# EAGLE design buckboost (EAGLE 6.6.0)
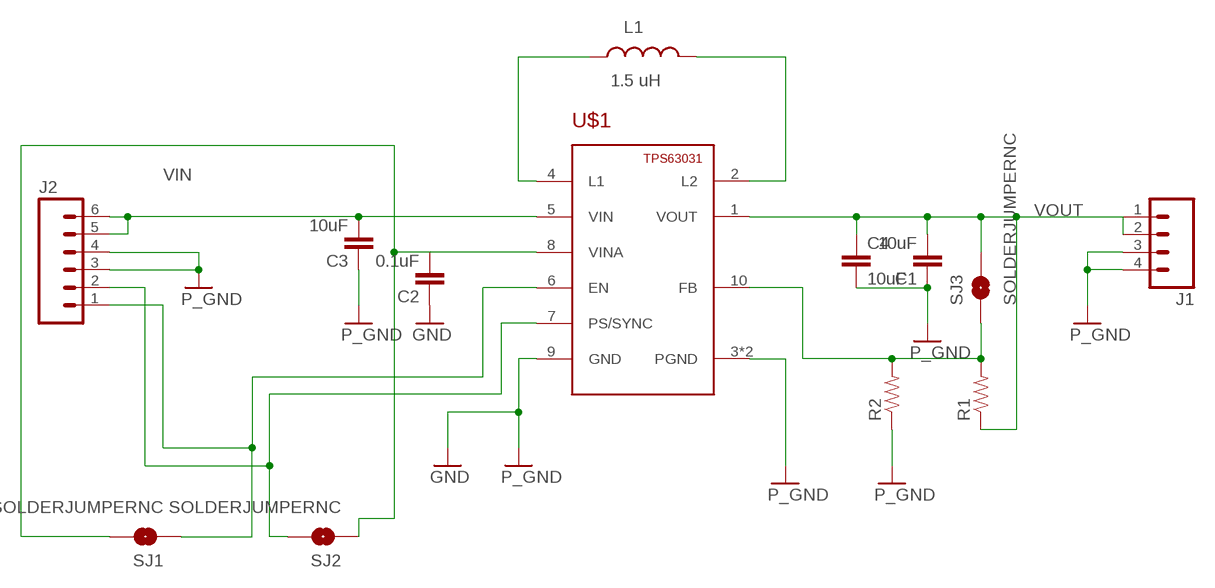
[diagram p0: schematic, sheet 1]

## Parts
C1  10uF  CAP1206  [1206]
C2  0.1uF  CAP1206  [1206]
C3  10uF  CAP1206  [1206]
C4  10uF  CAP1206  [1206]
J1  M04PTH  [1X04]
J2  M06SILK_FEMALE_PTH  [1X06]
L1  1.5 uH  INDUCTOR  [IND1212]
R1  RESISTOR1206  [1206]
R2  RESISTOR1206  [1206]
SJ1  SOLDERJUMPERNC  [SJ_2S]
SJ2  SOLDERJUMPERNC  [SJ_2S]
SJ3  SOLDERJUMPERNC  [SJ_2S]
U$1  TPS63031  [SON-10]

## Nets
GND: C1.1 C2.1 C3.1 C4.2 J1.3 J1.4 J2.3 J2.4 R2.1 U$1.3(PGND) U$1.9(GND) U$1.PAD(PGND) ; supply symbol labelled P_GND
L1: L1.P$1 U$1.4(L1)
L2: L1.P$2 U$1.2(L2)
N$1: R1.2 R2.2 SJ3.1 U$1.10(FB)
N$3: C2.2 SJ1.2 SJ2.1 U$1.8(VINA)
N$4: J2.2 SJ2.2 U$1.7(PS/SYNC)
N$5: J2.1 SJ1.1 U$1.6(EN)
VIN: C3.2 J2.5 J2.6 U$1.5(VIN)
VOUT: C1.2 C4.1 J1.1 J1.2 R1.1 SJ3.2 U$1.1(VOUT)

## Library data of the parts
C1-C4 = SparkFun-Capacitors:CAP: Capacitor Standard 0603 ceramic capacitor, and 0.1" leaded capacitor.
J1 = SparkFun-Connectors:M04: Header 4 Standard 4-pin 0.1" header. Use with straight break away headers (SKU : PRT-00116), right angle break away headers (PRT-00553), swiss pins (PRT-00743), machine pins (PRT-00117), and female headers (PRT-00115). Molex polarized connector foot print use with SKU : PRT-08231 with associated crimp pins and housings. 1MM SMD Version SKU: PRT-10208; PROD_ID: CONN-09696
J2 = SparkFun-Connectors:M06: Header 6 Standard 6-pin 0.1" header. Use with straight break away headers (SKU : PRT-00116), right angle break away headers (PRT-00553), swiss pins (PRT-00743), machine pins (PRT-00117), and female headers (PRT-00115). Molex polarized connector foot print use with SKU : PRT-08094 with associated crimp pins and housings. NOTES ON THE VARIANTS LOCK and LOCK_LONGPADS... This footprint was designed to help hold the alignment of a through-hole component (i.e. 6-pin header) while soldering it into place. You may notice that each hole has been shifted either up or down by 0.005 of an inch from it's more standard position (which is a perfectly straight line). This slight alteration caused the pins (the squares in the middle) to touch the edges of the holes. Because they are alternating, it causes a "brace" to hold the component in place. 0.005 has proven to be the perfect amount of "off-center" position when using our standard breakaway headers. Although looks a little odd when you look at the bare footprint, once you have a header in there, the alteration is very hard to notice. Also,if you push a header all the way into place, it is covered up entirely on the bottom side. This idea of altering the position of holes to aid alignment will be further integrated into the Sparkfun Library for other footprints. It can help hold any component with 3 or more connection pins.; PROD_ID: CONN-08437
L1 = Capstone Library:INDUCTOR: Inductors Basic Inductor/Choke - 0603 and 1206. Footprints are not proven and vary greatly between part numbers. INDUCTOR POWER 3.3UH 4.0A SMD 0.197" L x 0.197" W x 0.177" H (5.00mm x 5.00mm x 4.50mm)
R1 R2 = SparkFun-Resistors:RESISTOR: Resistor Basic schematic elements and footprints for 0603, 1206, and PTH resistors.
SJ1-SJ3 = SparkFun-Retired:SOLDERJUMPER: Solder Jumper Standard SMD solder jumper. Used to automate production. Two varients : Normally Open and Normally Closed are the same, but have different paste layers. NC will have a large amount of paste and should jumper during reflow.
U$1 = Capstone Library:TPS63031

## Board
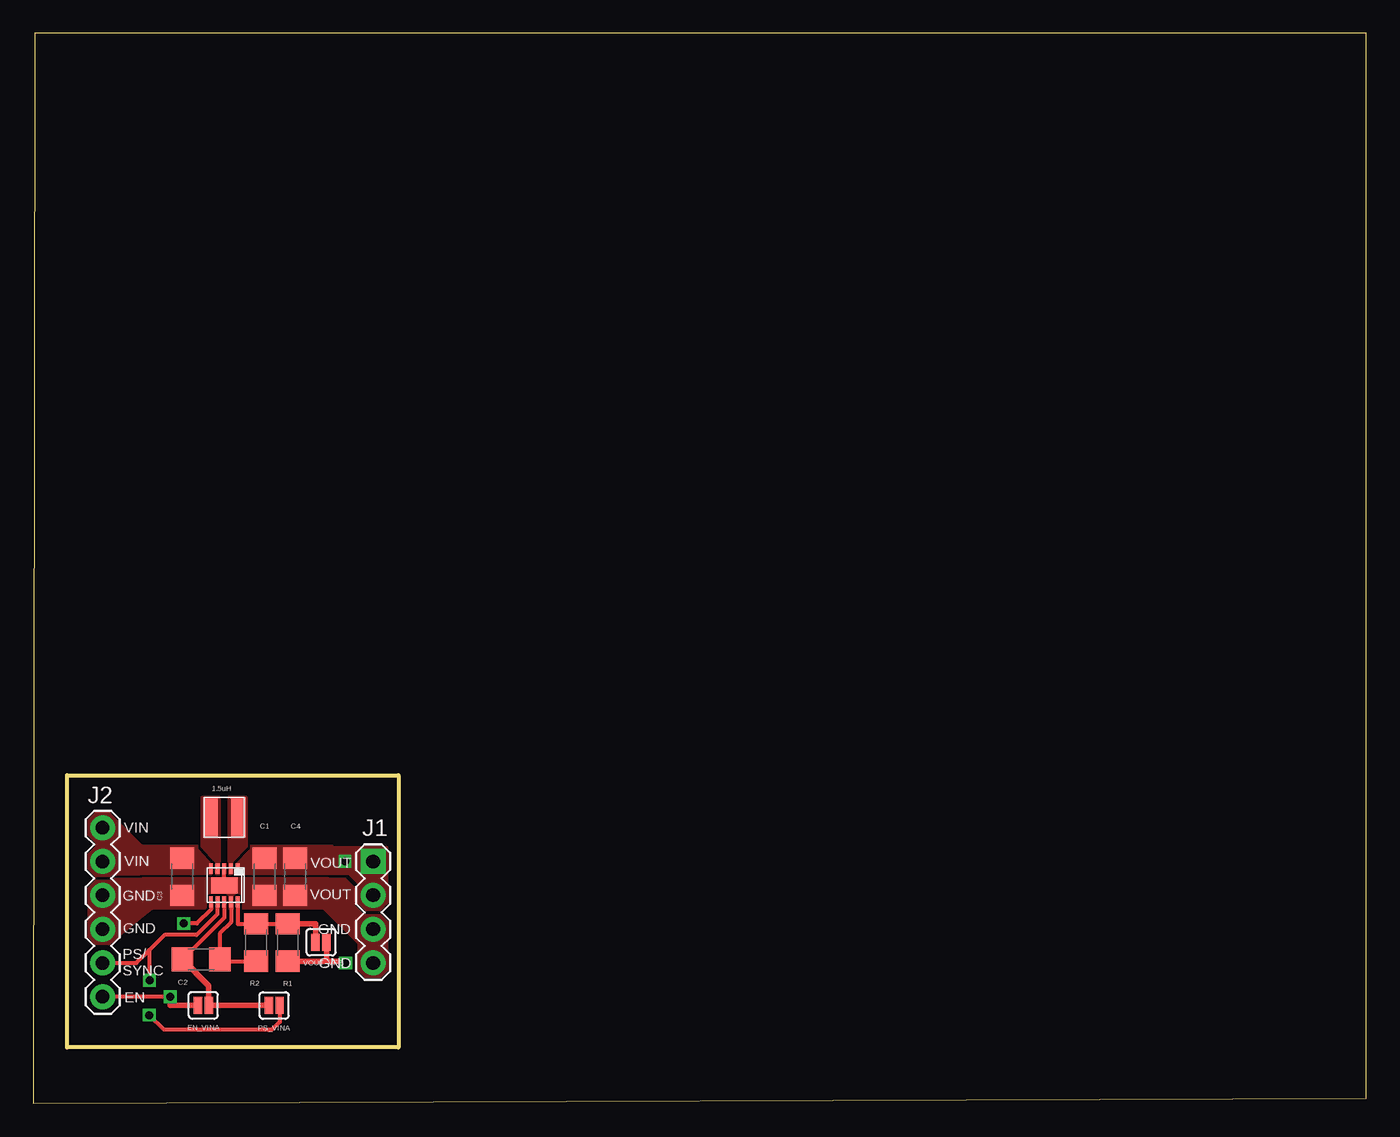
[diagram p1: board, top side]
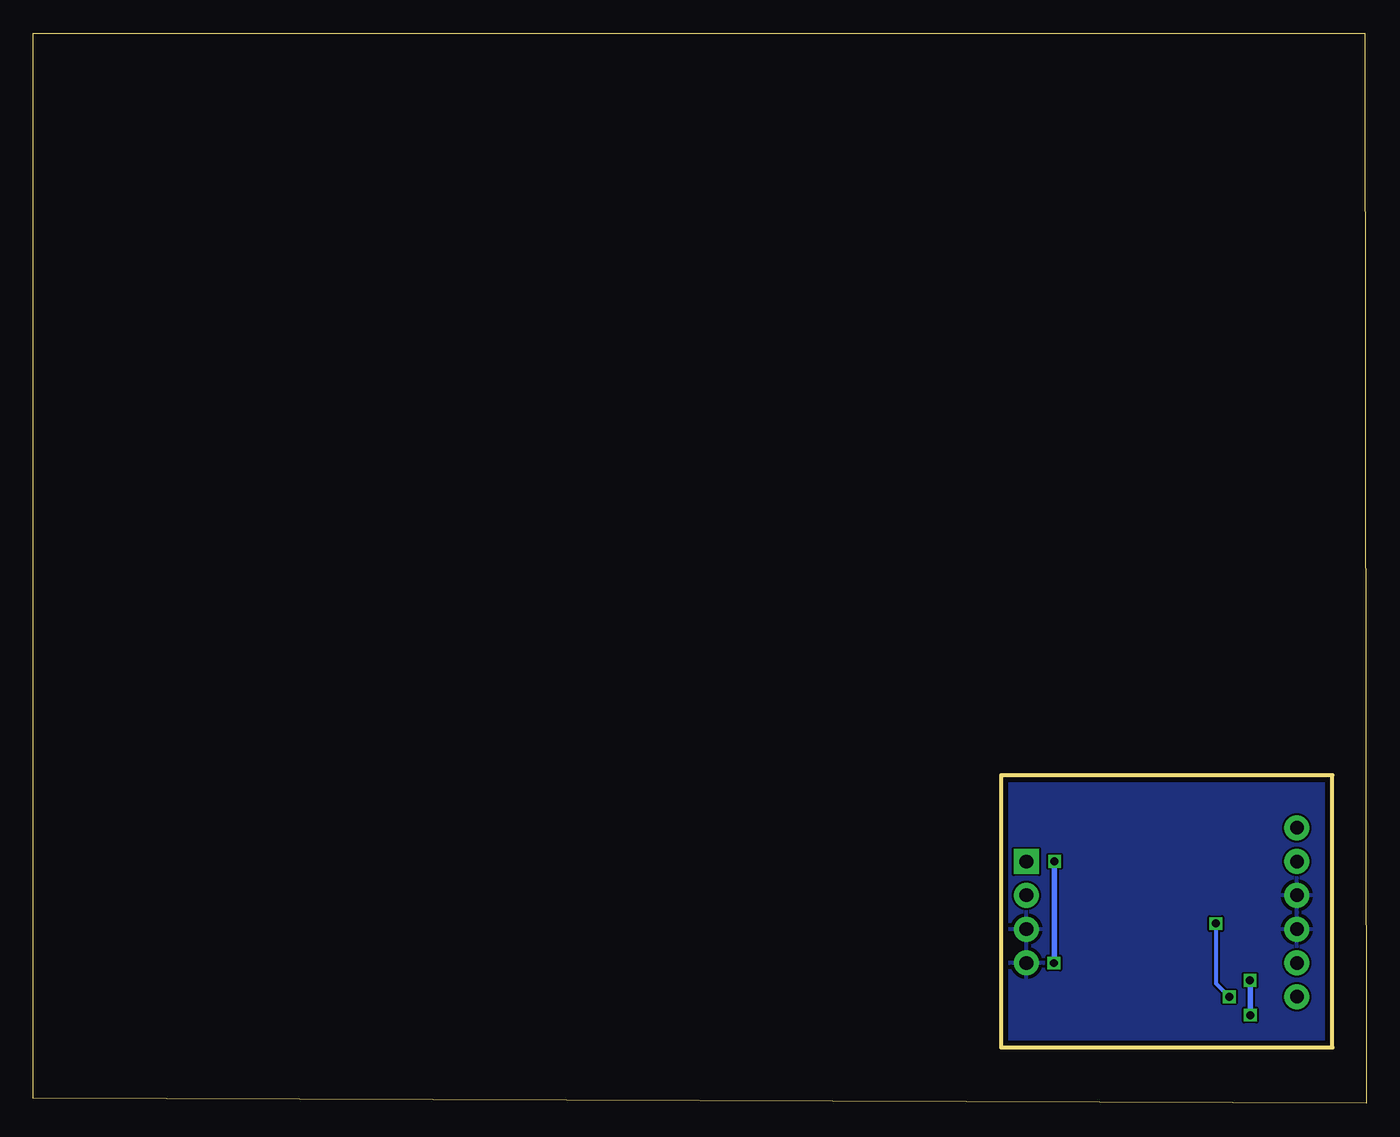
[diagram p2: board, bottom side, seen from below]

Size 100.13 x 80.38 mm. Coordinates in mm from the lower left corner, seen from the top.
Outline: 0,0 100.13,0.38 100.13,80.38 0.13,80.38 0,0
Outline: 2.54,24.64 27.43,24.64 27.43,4.19 2.54,4.19 2.54,24.64
Copper layers (1*16): Top 0.0356mm / dielectric 1.5011mm / Bottom 0.0356mm
Design rules "OSH Park *": minimum track width 6mil, minimum drill 13mil, track to track 6mil, track to pad 6mil, pad to pad 6mil, via to via 6mil, smd to smd 6mil, copper to edge 15mil, drill to drill 6mil, minimum pad ring 7mil, minimum via ring 7mil, stop-mask expansion 3mil, vias tented up to drill 0mil, thermal gap 10mil

### Footprints (pad centres in the part's own frame; a part is rotated, then mirrored left to right if it is on the bottom)
1206 = smd 1.6 x 1.8: 1 -1.4,0; 2 1.4,0
1X04 = drill 1.016 pad 1.88 square: 1 0,0 | drill 1.016 pad 1.88: 2 2.54,0; 3 5.08,0; 4 7.62,0
1X06 = drill 1.016 pad 1.88: 1 0,0; 2 2.54,0; 3 5.08,0; 4 7.62,0; 5 10.16,0; 6 12.7,0
IND1212 = smd 1.1 x 3: P$1 -1.05,0; P$2 1.05,0
SJ_2S = smd 0.635 x 1.27: 1 -0.412,0; 2 0.412,0
SON-10 = smd 0.28 x 0.8: 1 -1,-1.25; 2 -0.5,-1.25; 3 0,-1.25; 4 0.5,-1.25; 5 1,-1.25; 6 1,1.25; 7 0.5,1.25; 8 0,1.25; 9 -0.5,1.25; 10 -1,1.25 | smd 2 x 1.2: PAD 0,0

### Placement (x,y rotation side)
C1  17.4,17.02 90 top
C2  12.61,10.8 180 top
C3  11.17,17.02 90 top
C4  19.68,17.02 270 top
J1  25.53,18.16 270 top
J2  5.21,8 90 top
L1  14.35,21.46 0 top
R1  19.12,12.07 90 top
R2  16.73,12.08 90 top
SJ1  12.77,7.36 0 top
SJ2  18.09,7.35 0 top
SJ3  21.62,12.1 0 top
U$1  14.35,16.38 180 top

### Tracks (layer width: path | path; a pad name or v marks a point on that pad's centre or on a via)
GND
  Top 0.305: U$1.PAD U$1.3 | U$1.9 14.85,13.61 14.01,12.77 C2.1 | C2.1 | C2.1 14.01,10.68 R2.1
  pour Top (rank 3, no thermals): 13.97,16.89 8,16.89 8,14.73 22.09,14.73 22.09,16.89 14.6,16.89 14.35,17.65
  pour Bottom (rank 2): 3.06,24.17 26.94,24.17 26.81,4.61 2.93,4.61
  pour Top (rank 3, no thermals): 4.7,16.64 4.19,16.13 4.19,12.57 4.7,12.06 5.71,12.06 8.89,14.73 8.76,16.83 8.25,16.83 6.16,16.83 5.84,16.51 5.71,16.64
  pour Top (rank 3, no thermals): 6.22,12.57 9.27,14.99 8.51,14.99 6.22,12.7
  pour Top (rank 2, no thermals): 25.02,14.07 26.06,14.07 26.52,13.61 26.52,10.01 26.04,9.53 24.99,9.53 24.51,10.01 24.51,11.73 24.51,12.01 21.79,14.73 21.79,16.81 23.39,16.81 23.98,16.23 23.98,14.88 24.79,14.07 24.99,14.07
L1
  pour Top (no thermals): 13.97,22.99 13.97,17.27 13.71,17.27 13.71,18.13 13.71,18.16 12.7,19.3 12.7,22.99
L2
  pour Top (no thermals): 14.73,17.27 14.73,22.99 16,22.99 16,19.3 14.91,18.15 14.91,17.27
N$1
  Top 0.305: U$1.10 15.36,15.13 15.36,13.46 16.73,13.46 R2.2 R1.2 19.19,13.54
  Top 0.406: SJ3.1 21.21,13.47 R1.2
N$3
  Top 0.305: U$1.8 14.35,13.94 C2.2
  Top 0.406: C2.2 13.18,8.84 SJ1.2 17.67,7.36 SJ2.1
N$4  (via drill 0.6)
  Top 0.305: U$1.7 13.84,14.22 12.7,13.08 12.69,13.08 12.26,12.65 9.86,12.65 8.7,11.49 | J2.2 7.75,10.54 8.7,11.49 | v8.73,9.23 8.73,11.46 8.7,11.49 | SJ2.2 18.51,6.12 17.91,5.52 9.82,5.52 v8.71,6.62
  Bottom 0.406: v8.71,6.62 8.71,9.22 v8.73,9.23
N$5  (via drill 0.6)
  Top 0.305: U$1.6 13.35,14.57 12.28,13.5 v11.29,13.5 | v10.29,8 J2.1
  Top 0.406: SJ1.1 10.29,7.36 v10.29,8
  Bottom 0.305: v11.29,13.5 11.29,9 v10.29,8
VIN
  pour Top (rank 2, no thermals): 13.84,17.27 8,17.27 8,19.3 12.32,19.3 13.84,18.03
  pour Top (rank 2, no thermals): 8.12,19.3 5.71,21.72 4.7,21.72 4.19,21.21 4.19,20.19 4.82,19.56 4.82,19.3 4.19,18.67 4.19,17.65 4.7,17.14 5.71,17.14 5.84,17.27 8,17.27 8.12,17.4
VOUT  (via drill 0.6)
  Top 0.305: R1.1
  Top 0.406: R1.1 22.03,10.67 | v23.46,10.53 23.46,10.67 22.03,10.67 | 22.03,10.67 SJ3.2
  Bottom 0.406: v23.46,10.53 23.41,10.53 v23.41,18.17
  pour Top (rank 2, no thermals): 22.09,17.27 15.11,17.27 15.11,18.16 16.25,19.3 22.09,19.3
  pour Top (rank 2, no thermals): 22.1,19.3 22.38,19.3 22.5,19.18 26.09,19.18 26.54,19.18 26.52,19.15 26.52,15.09 26.01,14.58 25.98,14.55 25.04,14.55 24.51,15.09 24.51,16.51 24.31,16.71 23.75,17.27 21.39,17.27 22.1,17.98

### Text on the board
tPlace: 1.5uH | VIN | VIN | VOUT | GND | VOUT | GND | GND | VOUT_VFB | GND | PS/ / SYNC | EN | EN_VINA | PS_VINA